# Altium schematic sheet NEO6MV2.SchDoc
size A4
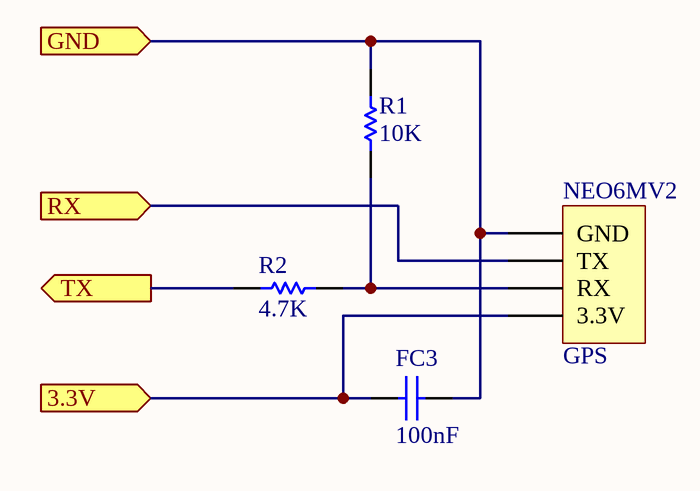
[diagram p0: NEO6MV2.SchDoc]

## Parts
FC3  100nF  [RAD-0.3]
NEO6MV2  GPS  [HDR1X4]
R1  10K  [AXIAL-0.3]
R2  4.7K  [AXIAL-0.3]

## Ports
3.3V (in), GND (in), RX (in), TX (out)

## Nets
3.3V: FC3.1 NEO6MV2.4(3.3V) ; port 3.3V
GND: FC3.2 NEO6MV2.1(GND) R1.2 ; port GND
RX: NEO6MV2.2(TX) ; port RX
TX: R2.1 ; port TX
NetNEO6MV2_3: NEO6MV2.3(RX) R1.1 R2.2

## Library data of the parts
FC3 = Cap: Capacitor; Published: 8-Jun-2000; LatestRevisionDate: 17-Jul-2002; LatestRevisionNote: Re-released for DXP Platform.; PackageReference: RAD-0.3; Publisher: Altium Limited; PackageDescription: Radial Cap, Thru-Hole; 2 Leads; 0.3 in Pin Spacing; Value: 100nF
NEO6MV2 = Header 4: Header, 4-Pin; LatestRevisionDate: 17-Jul-2002; LatestRevisionNote: Re-released for DXP Platform.; Publisher: Altium Limited
R1 R2 = Res1: Resistor; Published: 8-Jun-2000; LatestRevisionDate: 17-Jul-2002; LatestRevisionNote: Re-released for DXP Platform.; PackageReference: AXIAL-0.3; Publisher: Altium Limited; PackageDescription: Axial Device, Thru-Hole; 2 Leads; 0.3 in Pin Spacing
  R1: Value: 10K
  R2: Value: 4.7K